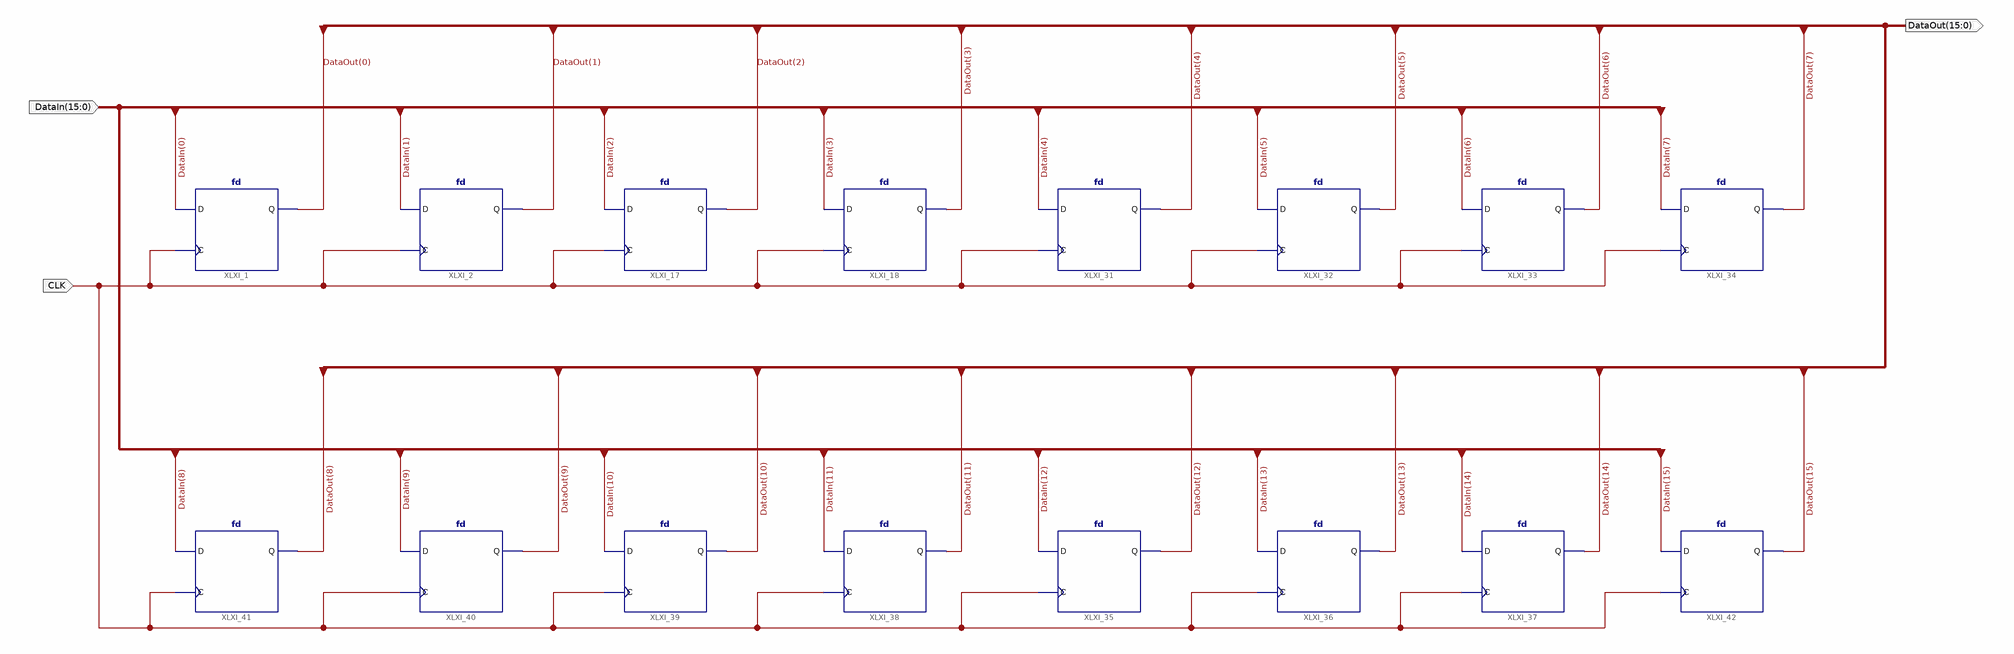
[diagram p0: schematic sheet 1]
// Xilinx ISE schematic RegPIPO_16.sch (spartan6) as structural Verilog: 16 symbols, 3 ports
module RegPIPO_16 (
  input  CLK,
  input  [15:0] DataIn,
  output [15:0] DataOut
);

  fd XLXI_31 (.C(CLK), .D(DataIn[4]), .Q(DataOut[4]));
  fd XLXI_32 (.C(CLK), .D(DataIn[5]), .Q(DataOut[5]));
  fd XLXI_33 (.C(CLK), .D(DataIn[6]), .Q(DataOut[6]));
  fd XLXI_18 (.C(CLK), .D(DataIn[3]), .Q(DataOut[3]));
  fd XLXI_17 (.C(CLK), .D(DataIn[2]), .Q(DataOut[2]));
  fd XLXI_2 (.C(CLK), .D(DataIn[1]), .Q(DataOut[1]));
  fd XLXI_1 (.C(CLK), .D(DataIn[0]), .Q(DataOut[0]));
  fd XLXI_34 (.C(CLK), .D(DataIn[7]), .Q(DataOut[7]));
  fd XLXI_35 (.C(CLK), .D(DataIn[12]), .Q(DataOut[12]));
  fd XLXI_36 (.C(CLK), .D(DataIn[13]), .Q(DataOut[13]));
  fd XLXI_37 (.C(CLK), .D(DataIn[14]), .Q(DataOut[14]));
  fd XLXI_38 (.C(CLK), .D(DataIn[11]), .Q(DataOut[11]));
  fd XLXI_39 (.C(CLK), .D(DataIn[10]), .Q(DataOut[10]));
  fd XLXI_40 (.C(CLK), .D(DataIn[9]), .Q(DataOut[9]));
  fd XLXI_41 (.C(CLK), .D(DataIn[8]), .Q(DataOut[8]));
  fd XLXI_42 (.C(CLK), .D(DataIn[15]), .Q(DataOut[15]));
endmodule
